# Altium schematic sheet [1] Cube Power.SchDoc
size A4
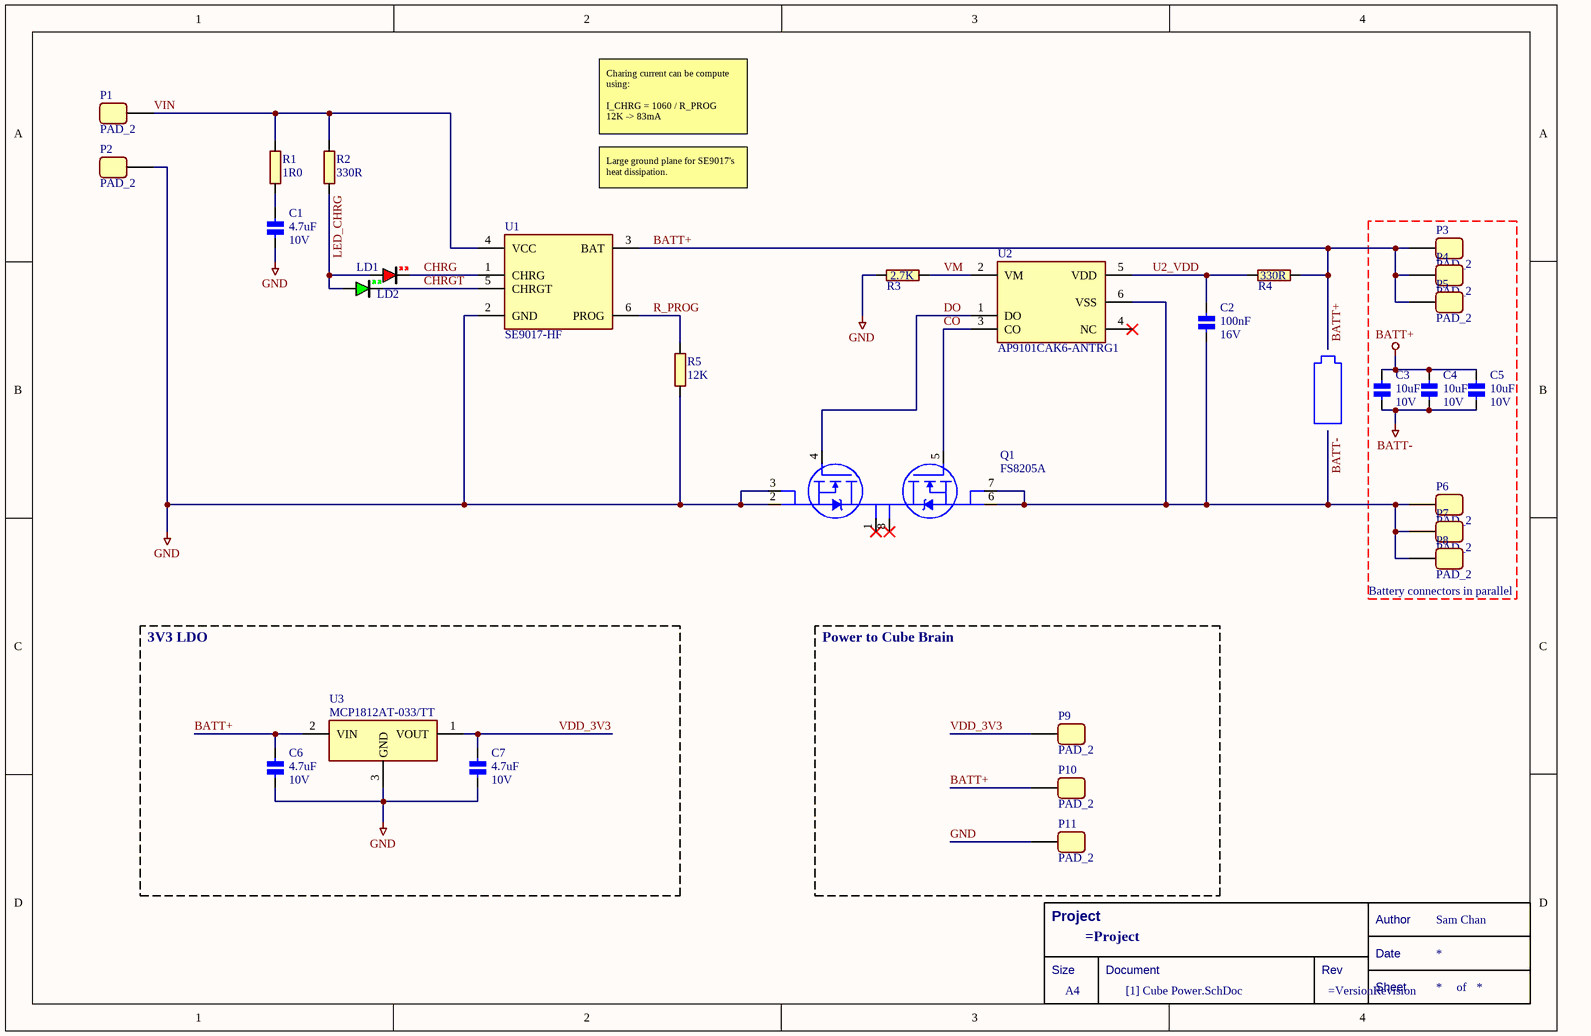
[diagram p0: [1] Cube Power.SchDoc]

## Parts
*?  Title Block  (value not drawn)  (graphical)
C1  Voltage - Rated: 10V  [CAPC0402X05N]  (hidden comment: 4.7uF)
C2  Voltage - Rated: 16V  [CAPC0402X05N]  (hidden comment: 100nF)
C3  Voltage - Rated: 10V  [CAPC0402X05N]  (hidden comment: 10uF)
C4  Voltage - Rated: 10V  [CAPC0402X05N]  (hidden comment: 10uF)
C5  Voltage - Rated: 10V  [CAPC0402X05N]  (hidden comment: 10uF)
C6  Voltage - Rated: 10V  [CAPC0402X05N]  (hidden comment: 4.7uF)
C7  Voltage - Rated: 10V  [CAPC0402X05N]  (hidden comment: 4.7uF)
LD1  Red  [LEDM0603X08N_RED]  (value not drawn)
LD2  Green  [LEDM0603X08N_GREEN]  (value not drawn)
P1  PAD_2  [BATT_PAD]  (no BOM)
P2  PAD_2  [BATT_PAD]  (no BOM)
P3  PAD_2  [BATT_PAD]  (no BOM)
P4  PAD_2  [BATT_PAD]  (no BOM)
P5  PAD_2  [BATT_PAD]  (no BOM)
P6  PAD_2  [BATT_PAD]  (no BOM)
P7  PAD_2  [BATT_PAD]  (no BOM)
P8  PAD_2  [BATT_PAD]  (no BOM)
P9  PAD_2  [BATT_PAD]  (no BOM)
P10  PAD_2  [BATT_PAD]  (no BOM)
P11  PAD_2  [BATT_PAD]  (no BOM)
Q1  FS8205A  [FS8205A]
R1  1R0  [RESC0402X04N]
R2  330R  [RESC0402X04N]
R3  2.7K  [RESC0402X04N]
R4  330R  [RESC0402X04N]
R5  12K  [RESC0402X04N]
U1  SE9017-HF  [SE9017-HF]
U2  AP9101CAK6-ANTRG1  [AP9101CAK6]
U3  MCP1812AT-033/TT  [MCP1812AT-033/TT]

## Blocks framed on the sheet
Battery connectors in parallel: C3-C5 P3-P8
3V3 LDO: C6 C7 U3
Power to Cube Brain: P9-P11

## Nets
BATT+: C3.1 C4.1 C5.1 C6.1 P3.1 P4.1 P5.1 P10.1 R4.2 U1.3(BAT) U3.2(VIN)
BATT-: C2.2 C3.2 C4.2 C5.2 P6.1 P7.1 P8.1 Q1.6(S2) Q1.7(S2) U2.6(VSS)
GND: C1.2 C6.2 C7.2 P2.1 P11.1 Q1.2(S1) Q1.3(S1) R3.1 R5.2 U1.2(GND) U3.3(GND)
CHRG: LD1.2 U1.1(CHRG)
CHRGT: LD2.2 U1.5(CHRGT)
CO: Q1.5(G2) U2.3(CO)
DO: Q1.4(G1) U2.1(DO)
LED_CHRG: LD1.1 LD2.1 R2.1
R_PROG: R5.1 U1.6(PROG)
U2_VDD: C2.1 R4.1 U2.5(VDD)
VDD_3V3: C7.1 P9.1 U3.1(VOUT)
VIN: P1.1 R1.2 R2.2 U1.4(VCC)
VM: R3.2 U2.2(VM)
NetC1_1: C1.1 R1.1

Not connected (* = marked no-connect by the designer): Q1 1(D12)* 8(D12)*; U2 4(NC)*

## Notes on the sheet
- Charing current can be compute using:
  I_CHRG = 1060 / R_PROG
  12K -> 83mA
- Large ground plane for SE9017's heat dissipation.
- (in symbol Title Block) Project; Author; Sam Chan; Date; Size; Document; Rev; A4; Sheet; of

## Library data of the parts
*? = Title Block: Standard Title Block
C1 C6 C7 = CER 4.7UF 10V: CAP CER 4.7UF 10V X5R 0402; Manufacturer: Samsung Electro-Mechanics; Manufacturer Part Number: CL05A475MP5NRNC; Category: Capacitors; Supplier 1: LCSC; Supplier Part Number 1: C23733; Package / Case: 0402; Capacitance: 4.7uF
C2 = CER 100NF 16V: CAP CER 0.1UF 16V X7R 0402; Manufacturer: Samsung Electro-Mechanics; Manufacturer Part Number: CL05B104KO5NNNC; Category: Capacitors; Supplier 1: LCSC; Supplier Part Number 1: C1525; Package / Case: 0402; Capacitance: 100nF
C3-C5 = CER 10UF 10V: CAP CER 10UF 10V X5R 0402; Manufacturer: Murata Electronics; Manufacturer Part Number: GRM155R61A106ME44D; Category: Capacitors; Supplier 1: LCSC; Supplier Part Number 1: C77000; Package / Case: 0402; Capacitance: 10uF
LD1 = LED 0603 RED: LED RED CLEAR CHIP SMD; Manufacturer: Lite-On Inc.; Manufacturer Part Number: LTST-C190KRKT; Category: LED; Package / Case: 0603 (1608 Metric); Color: Red; Supplier 1: LCSC; Supplier Part Number 1: C94869
LD2 = LED 0603 GREEN: LED GREEN CLEAR CHIP SMD; Manufacturer: Lite-On Inc.; Manufacturer Part Number: LTST-C190KGKT; Category: LED; Package / Case: 0603 (1608 Metric); Color: Green; Supplier 1: LCSC; Supplier Part Number 1: C125094
P1-P11 = PAD_2: a Pad
Q1 = FS8205A: MOSFET 2N-CH 20V 6A TSSOP8; Manufacturer: Fortune Semicon; Category: Transistors; Case: TSSOP-8; Manufacturer Part Number: FS8205A; Supplier 1: LCSC; Supplier Part Number 1: C16052
R1 = RES 1R: RES SMD 11RK OHM 1% 1/16W 0402; Manufacturer: YAGEO; Manufacturer Part Number: RC0402FR-071RL; Category: Resistors; Package / Case: 0402; Supplier 1: LCSC; Supplier Part Number 1: C185446; Resistance: 1R0
R2 R4 = RES 330R: RES SMD 330R OHM 1% 1/16W 0402; Manufacturer: YAGEO; Manufacturer Part Number: RC0402FR-07330RL; Category: Resistors; Package / Case: 0402; Supplier 1: LCSC; Supplier Part Number 1: C105875; Resistance: 330R
R3 = RES 2.7K: RES SMD 2.7K OHM 1% 1/16W 0402; Manufacturer: YAGEO; Manufacturer Part Number: AC0402FR-072K7L; Category: Resistors; Package / Case: 0402; Supplier 1: LCSC; Supplier Part Number 1: C144771; Resistance: 2.7K
R5 = RES 12K: RES SMD 12K OHM 1% 1/16W 0402; Manufacturer: YAGEO; Manufacturer Part Number: RC0402FR-0712KL; Category: Resistors; Package / Case: 0402; Supplier 1: LCSC; Supplier Part Number 1: C114760; Resistance: 12K
U1 = SE9017-HF: IC LI-ION/LI-POLY CTRLR SOT23-6; Manufacturer: Seaward Elec; Category: PMIC - Battery Chargers; Case: SOT-23-6; Manufacturer Part Number: SE9017-HF; Supplier 1: LCSC; Supplier Part Number 1: C115751
U2 = AP9101CAK6-ANTRG1: IC BATT PROT LI-ION 1-CELL SOT26; Manufacturer: Diodes Incorporated; Category: PMIC - Battery Management; Case: SOT-23-6; Manufacturer Part Number: AP9101CAK6-ANTRG1; Supplier 1: Digi-Key; Supplier Part Number 1: AP9101CAK6-ANTRG1DICT-ND
U3 = MCP1812AT-033/TT: IC REG LINEAR 3.3V 300MA SOT23-3; Manufacturer: Microchip Technology; Categories: Voltage Regulators - Linear; Case: TO-236-3, SC-59, SOT-23-3; Manufacturer Part Number: MCP1812AT-033/TT; Supplier 1: Digi-Key; Supplier Part Number 1: MCP1812AT-033/TTCT-ND